# EAGLE design SparkFun_GPS_Evaluation_Board_GP-2106 (EAGLE 7.2.0)
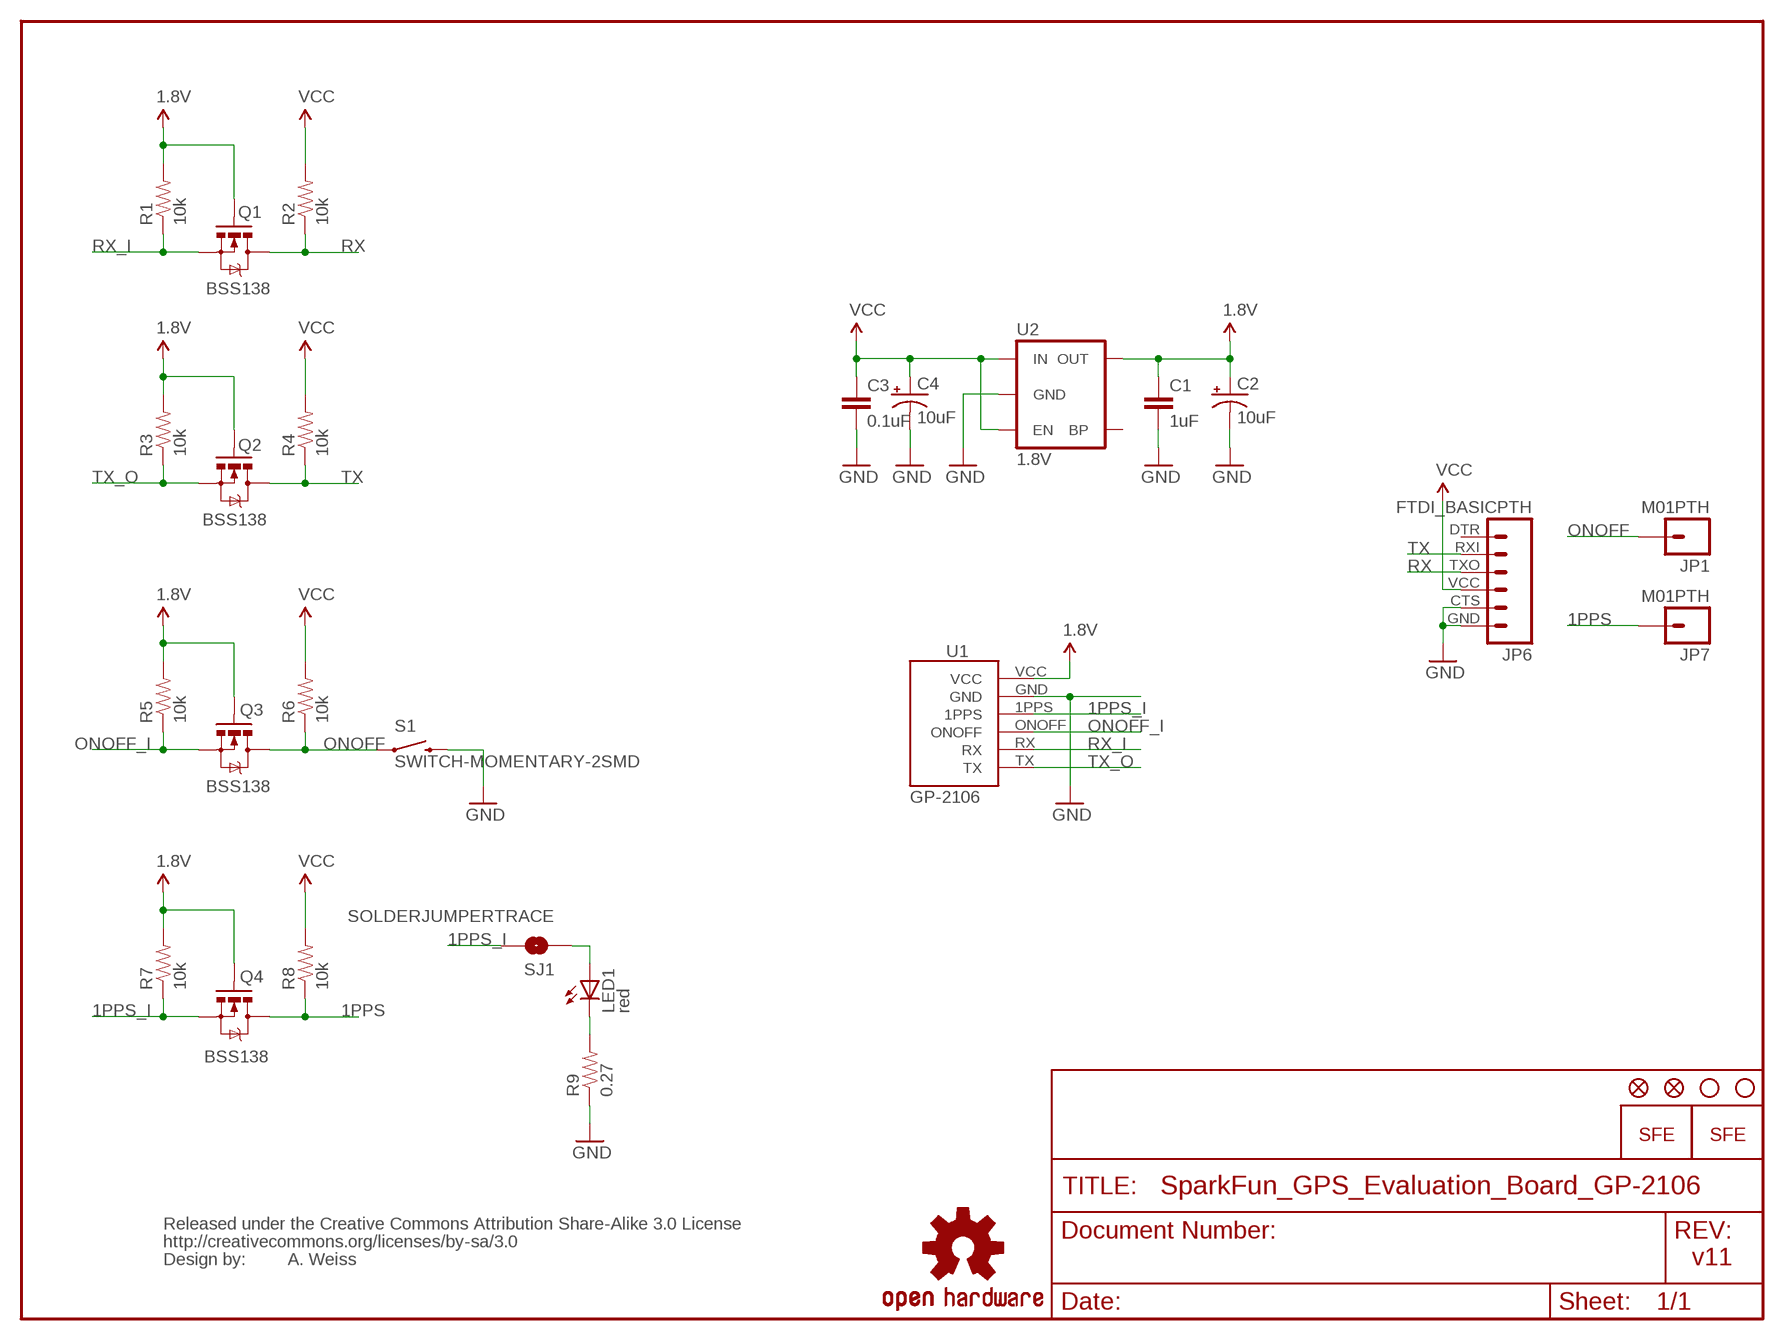
[diagram p0: schematic, sheet 1]

## Parts
C1  1uF  CAP0402-CAP  [0402-CAP]
C2  10uF  CAP_POL1206  [EIA3216]
C3  0.1uF  CAP0402-CAP  [0402-CAP]
C4  10uF  CAP_POL1206  [EIA3216]
JP1  M01PTH  [1X01]
JP2  STAND-OFF  [STAND-OFF]
JP3  STAND-OFF  [STAND-OFF]
JP4  LOGO-SFESK  [SFE-LOGO-FLAME]
JP5  LOGO-SFENEW  [SFE-NEW-WEBLOGO]
JP6  FTDI_BASICPTH  [FTDI_BASIC]
JP7  M01PTH  [1X01]
JP8  FIDUCIALUFIDUCIAL  [MICRO-FIDUCIAL]
JP9  FIDUCIALUFIDUCIAL  [MICRO-FIDUCIAL]
LED1  red  LED0603  [LED-0603]
Q1  MOSFET-NCHANNELSMD  [SOT23-3]
Q2  MOSFET-NCHANNELSMD  [SOT23-3]
Q3  MOSFET-NCHANNELSMD  [SOT23-3]
Q4  MOSFET-NCHANNELSMD  [SOT23-3]
R1  10k  RESISTOR0402-RES  [0402-RES]
R2  10k  RESISTOR0402-RES  [0402-RES]
R3  10k  RESISTOR0402-RES  [0402-RES]
R4  10k  RESISTOR0402-RES  [0402-RES]
R5  10k  RESISTOR0402-RES  [0402-RES]
R6  10k  RESISTOR0402-RES  [0402-RES]
R7  10k  RESISTOR0402-RES  [0402-RES]
R8  10k  RESISTOR0402-RES  [0402-RES]
R9  0.27  RESISTOR0402-RES  [0402-RES]
S1  SWITCH-MOMENTARY-2SMD  [TACTILE_SWITCH_SMD]
SJ1  SOLDERJUMPERTRACE  [SJ_2S-TRACE]
U1  GP-2106  [GP-2106]
U2  V_REG_LDOSMD2  [SC70]
U$7  OSHW-LOGOS  [OSHW-LOGO-S]
U$8  CREATIVE_COMMONS  [CREATIVE_COMMONS]

## Nets
1.8V: C1.1 C2.A(+) Q1.1(G) Q2.1(G) Q3.1(G) Q4.1(G) R1.2 R3.2 R5.2 R7.2 U1.VCC U2.5(OUT)
1PPS: JP7.1 Q4.3(D) R8.1
1PPS_I: Q4.2(S) R7.1 SJ1.2 U1.1PPS
GND: C1.2 C2.C(-) C3.2 C4.C(-) JP6.CTS JP6.GND R9.1 S1.3 U1.GND U2.2(GND)
N$1: LED1.C R9.2
N$2: LED1.A SJ1.1
ONOFF: JP1.1 Q3.3(D) R6.1 S1.1
ONOFF_I: Q3.2(S) R5.1 U1.ONOFF
RX: JP6.TXO Q1.3(D) R2.1
RX_I: Q1.2(S) R1.1 U1.RX
TX: JP6.RXI Q2.3(D) R4.1
TX_O: Q2.2(S) R3.1 U1.TX
VCC: C3.1 C4.A(+) JP6.VCC R2.2 R4.2 R6.2 R8.2 U2.1(IN) U2.3(EN)
Unconnected: JP6.DTR U2.4(BP)

## Notes on the sheet
- BSS138
- 1.8V
- BSS138
- BSS138
- BSS138
- A. Weiss | v11

## Library data of the parts
C1 C3 = SparkFun:CAP: Capacitor Standard 0603 ceramic capacitor, and 0.1" leaded capacitor.
C2 C4 = SparkFun:CAP_POL: Capacitor Polarized These are standard SMD and PTH capacitors. Normally 10uF, 47uF, and 100uF in electrolytic and tantalum varieties. Always verify the external diameter of the through hole cap, it varies with capacity, voltage, and manufacturer. The EIA devices should be standard.
JP1 JP7 = SparkFun:M01: Header 1 Standard 1-pin 0.1" header. Use with straight break away headers (SKU : PRT-00116), right angle break away headers (PRT-00553), swiss pins (PRT-00743), machine pins (PRT-00117), and female headers (PRT-00115).
JP2 JP3 = SparkFun:STAND-OFF: Stand Off This is the mechanical footprint for a #4 phillips button head screw. Use the keepout ring to avoid running the screw head into surrounding components. SKU : PRT-00447
JP4 JP5 = SparkFun:LOGO-SFE: Spark Fun Electronics PCB Logo This is the standard Spark Fun Electronics PCB logo.
JP6 = SparkFun:FTDI_BASIC: FTDI Basic: 3.3V and 5V
JP8 JP9 = SparkFun:FIDUCIAL: Fiducial Alignment Points Various fiducial points for machine vision alignment.
LED1 = SparkFun:LED: LEDs Standard schematic elements and footprints for 5mm, 3mm, 1206, and 0603 sized LEDs. 5mm - Spark Fun Electronics SKU : COM-00529 (and others)
Q1-Q4 = SparkFun:MOSFET-NCHANNEL
R1-R9 = SparkFun:RESISTOR: Resistor Basic schematic elements and footprints for 0603, 1206, and PTH resistors.
S1 = SparkFun:SWITCH-MOMENTARY-2
SJ1 = SparkFun:SOLDERJUMPER: Solder Jumper Standard SMD solder jumper. Used to automate production. Two varients : Normally Open and Normally Closed are the same, but have different paste layers. NC will have a large amount of paste and should jumper during reflow.
U1 = SparkFun:GP-2106: GP-2106 GPS SiRF IV
U2 = SparkFun:V_REG_LDO: Voltage Regulator LDO Standard 150mA LDO voltage regulator in SOT-23 layout. Micrel part MIC5205. BP (by-pass) pin is used to lower output noise with 470pF cap.
U$7 = SparkFun:OSHW-LOGO: Open Source Hardware Logo This logo indicates the piece of hardware it is found on incorporates a OSHW license and/or adheres to the definition of open source hardware found here: http://freedomdefined.org/OSHW
U$8 = SparkFun:CREATIVE_COMMONS

## Board
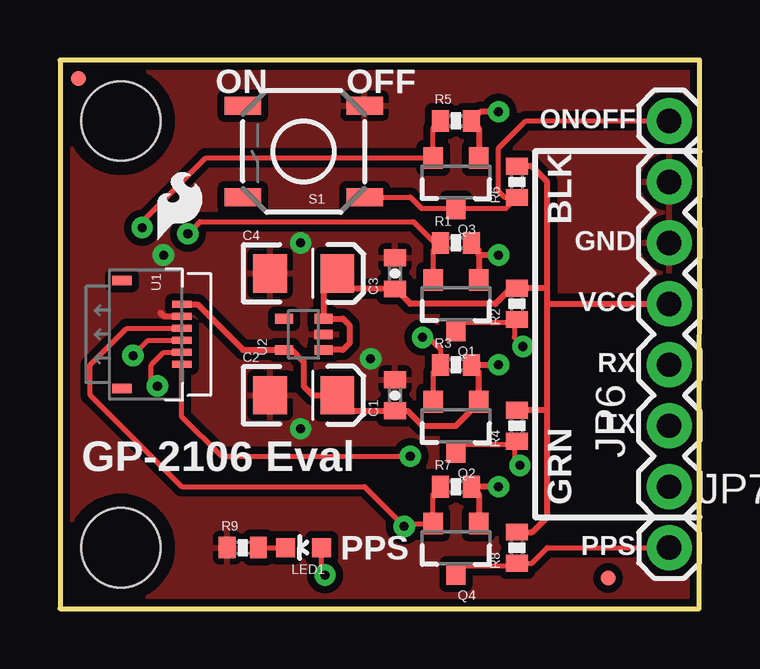
[diagram p1: board, top side]
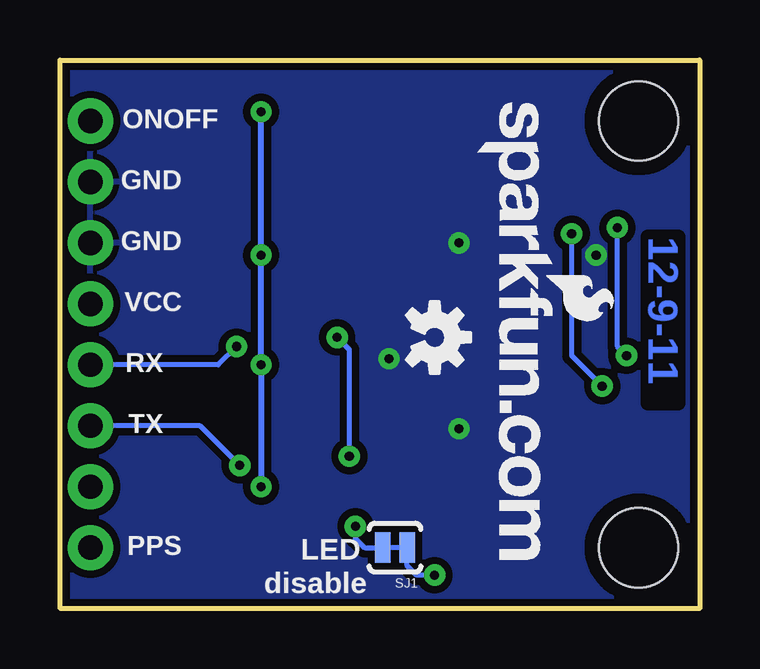
[diagram p2: board, bottom side, seen from below]

Size 26.67 x 22.86 mm. Coordinates in mm from the lower left corner, seen from the top.
Outline: 0,0 26.65,0 26.67,22.86 0,22.86 0,0
Copper layers (1*16): Top 0.0356mm / dielectric 1.5011mm / Bottom 0.0356mm
Design rules "default *": minimum track width 8mil, minimum drill 15mil, track to track 8mil, track to pad 8mil, pad to pad 8mil, via to via 8mil, smd to smd 8mil, copper to edge 10mil, drill to drill 8mil, minimum pad ring 12mil, minimum via ring 10mil, stop-mask expansion 4mil, vias tented up to drill 20mil, thermal gap 10mil

### Footprints (pad centres in the part's own frame; a part is rotated, then mirrored left to right if it is on the bottom)
0402-CAP = smd 0.7 x 0.9: 1 -0.65,0; 2 0.65,0
EIA3216 = smd 1.4 x 1.6: A 1.4,0; C -1.4,0
1X01 = drill 1.016 pad 1.88: 1 0,0
STAND-OFF = hole 3.302: 0,0
FTDI_BASIC = drill 1.016 pad 1.88: CTS 10.16,0; DTR 0,0; GND 12.7,0; RXI 2.54,0; TXO 5.08,0; VCC 7.62,0
MICRO-FIDUCIAL = smd 0.635 x 0.635: 1 0,0
LED-0603 = smd 0.8 x 0.8: A 0,-0.75; C 0,0.75
SOT23-3 = smd 0.8 x 0.9: 1 -0.95,-1; 2 0.95,-1; 3 0,1.1
0402-RES = smd 0.7 x 0.9: 1 -0.65,0; 2 0.65,0
TACTILE_SWITCH_SMD = smd 1.524 x 0.762: 1 -2.54,1.905; 2 2.54,1.905; 3 -2.54,-1.905; 4 2.54,-1.905
SJ_2S-TRACE = smd 0.635 x 1.27: 1 -0.508,0; 2 0.508,0
GP-2106 = smd 0.3 x 0.8: 1PPS -0.25,0; GND -0.75,0; ONOFF 0.25,0; RX 0.75,0; TX 1.25,0; VCC -1.25,0 | smd 0.4 x 0.8: P$7 -2.25,-2.5; P$8 2.25,-2.5
SC70 = smd 0.4 x 0.75: 1 -0.65,-0.825; 2 0,-0.825; 3 0.65,-0.825; 4 0.65,0.825; 5 -0.65,0.825

### Placement (x,y rotation side)
C1  13.97,8.89 90 top
C2  10.16,8.89 0 top
C3  13.97,13.97 90 top
C4  10.16,13.97 0 top
JP1  25.4,20.32 0 top
JP2  2.54,2.54 0 top
JP3  2.54,20.32 0 top
JP4  4.06,15.37 0 top
JP5  9.27,21.08 270 bottom
JP6  25.4,5.08 90 top
JP7  25.4,2.54 0 top
JP8  0.76,22.1 0 top
JP9  22.86,1.27 0 top
LED1  10.16,2.54 90 top
Q1  16.51,12.7 180 top
Q2  16.51,7.62 180 top
Q3  16.51,17.78 180 top
Q4  16.51,2.54 180 top
R1  16.51,15.24 0 top
R2  19.05,12.7 90 top
R3  16.51,10.16 0 top
R4  19.05,7.62 90 top
R5  16.51,20.32 0 top
R6  19.05,17.78 90 top
R7  16.51,5.08 0 top
R8  19.05,2.54 90 top
R9  7.62,2.54 0 top
S1  10.16,19.05 180 top
SJ1  12.7,2.54 180 bottom
U1  5.08,11.43 270 top
U2  10.16,11.43 90 top
U$7  11.05,11.3 270 bottom
U$8  20.32,-10.16 0 top  (outside the outline)

### Tracks (layer width: path | path; a pad name or v marks a point on that pad's centre or on a via)
1.8V  (via drill 0.38)
  Top 0.254: 17.46,14.73 Q1.1 | 17.46,14.73 17.46,14.94 R1.2 | Q3.1 17.46,20.02 R5.2 17.54,20.7 v18.29,20.7 | Q4.1 17.46,4.78 R7.2 v18.29,5.08 | U2.5 9.67,10.78 10.16,10.29 10.16,9.27 10.54,8.89 C2.A 12.21,8.24 C1.1 14.49,8.24 15.11,7.62 16.51,7.62 17.46,8.57 Q2.1 17.46,9.86 R3.2 v18.29,10.16 | U1.VCC 5.74,12.68 7.63,10.78 U2.5 | U2.5 9.32,10.79 | v18.29,14.73 17.46,14.73
  Bottom 0.254: v18.29,20.7 v18.29,14.73 v18.29,10.16 v18.29,5.08
1PPS
  Top 0.203: JP7.1 20.32,2.54 19.67,1.89 R8.1 18.94,1.78 16.76,1.78 16.76,1.65 16.55,1.44 Q4.3
1PPS_I  (via drill 0.38)
  Top 0.203: R7.1 15.56,4.78 Q4.2 14.46,3.54 v14.35,3.43 12.7,5.08 5.08,5.08 1.27,8.89 1.27,10.16 2.79,11.68 U1.1PPS
  Bottom 0.203: SJ1.2 13.97,2.54 14.35,2.92 v14.35,3.43
GND  (via drill 0.38)
  Top 0.254: U1.GND 4.33,12.18 4.19,12.32
  other vias: 10.03,15.24 12.95,10.41 10.03,7.49 4.32,14.73
  pour Top (isolate 0.305): 0,22.86 0,0 26.67,0 26.67,22.86
  pour Bottom (isolate 0.305): 0,22.86 0,0 26.67,0 26.67,22.86
N$1
  Top 0.203: R9.2 LED1.C
N$2  (via drill 0.38)
  Top 0.203: LED1.A 10.91,1.54 v11.05,1.4
  Bottom 0.203: v11.05,1.4 11.81,1.4 12.19,1.78 SJ1.1
ONOFF
  Top 0.203: JP1.1 19.43,20.32 18.29,19.18 18.29,17.4 18.56,17.13 R6.1 18.6,16.68 Q3.3 15.07,16.68 14.61,17.14 S1.1
ONOFF_I  (via drill 0.38)
  Top 0.203: R5.1 15.56,20.02 Q3.2 6.08,18.78 3.43,16.13 v3.43,15.88 | U1.ONOFF 3.69,11.18 v3.05,10.54
  Bottom 0.203: v3.43,15.88 3.43,10.92 v3.05,10.54
RX  (via drill 0.38)
  Top 0.203: Q1.3 16.51,11.68 16.76,11.94 18.94,11.94 | 18.94,11.94 R2.1 | 18.94,11.94 18.94,11.29 v19.3,10.92
  Bottom 0.203: JP6.TXO 20.07,10.16 v19.3,10.92
RX_I  (via drill 0.38)
  Top 0.203: Q1.2 15.56,14.94 15.62,15 15.62,15.24 | U1.RX 4.33,10.68 3.81,10.16 3.81,9.53 v4.06,9.27 | 15.62,15.24 R1.1 | 15.62,15.24 14.73,16.13 5.84,16.13 v5.33,15.62
  Bottom 0.203: v5.33,15.62 5.33,10.54 v4.06,9.27
TX  (via drill 0.38)
  Top 0.203: Q2.3 16.51,6.6 16.76,6.86 18.94,6.86 | 18.94,6.86 R4.1 | 18.94,6.86 18.94,6.21 v19.18,5.97
  Bottom 0.203: JP6.RXI 20.83,7.62 v19.18,5.97
TX_O  (via drill 0.38)
  Top 0.203: Q2.2 15.56,9.86 R3.1 15.86,10.81 15.37,11.3 v15.11,11.3 | U1.TX 5.08,8 6.73,6.35 v14.61,6.35
  Bottom 0.203: v14.61,6.35 14.61,10.79 v15.11,11.3
VCC
  Top 0.254: R6.2 19.67,18.43 20.32,17.78 20.32,13.34 | 20.32,8.26 20.32,3.81 19.7,3.19 R8.2 | 20.32,8.26 20.32,12.7 | 20.32,12.7 20.32,13.34 | 20.32,12.7 JP6.VCC | 20.32,13.34 20.3,13.35 R2.2 18.81,13.35 18.16,12.7 14.61,12.7 13.98,13.32 C3.1 12.21,13.32 C4.A 10.98,13.39 U2.3 11.8,12.08 12.06,11.81 12.06,11.05 11.8,10.78 U2.1 | R4.2 20.3,8.27 20.32,8.26

### Text on the board
Bottom: 12-9-11
tPlace: ON | OFF | ONOFF | BLK | GND | VCC | RX | TX | GP-2106 Eval | GRN | PPS | PPS
bPlace: ONOFF | GND | GND | VCC | RX | TX | PPS | LED | disable